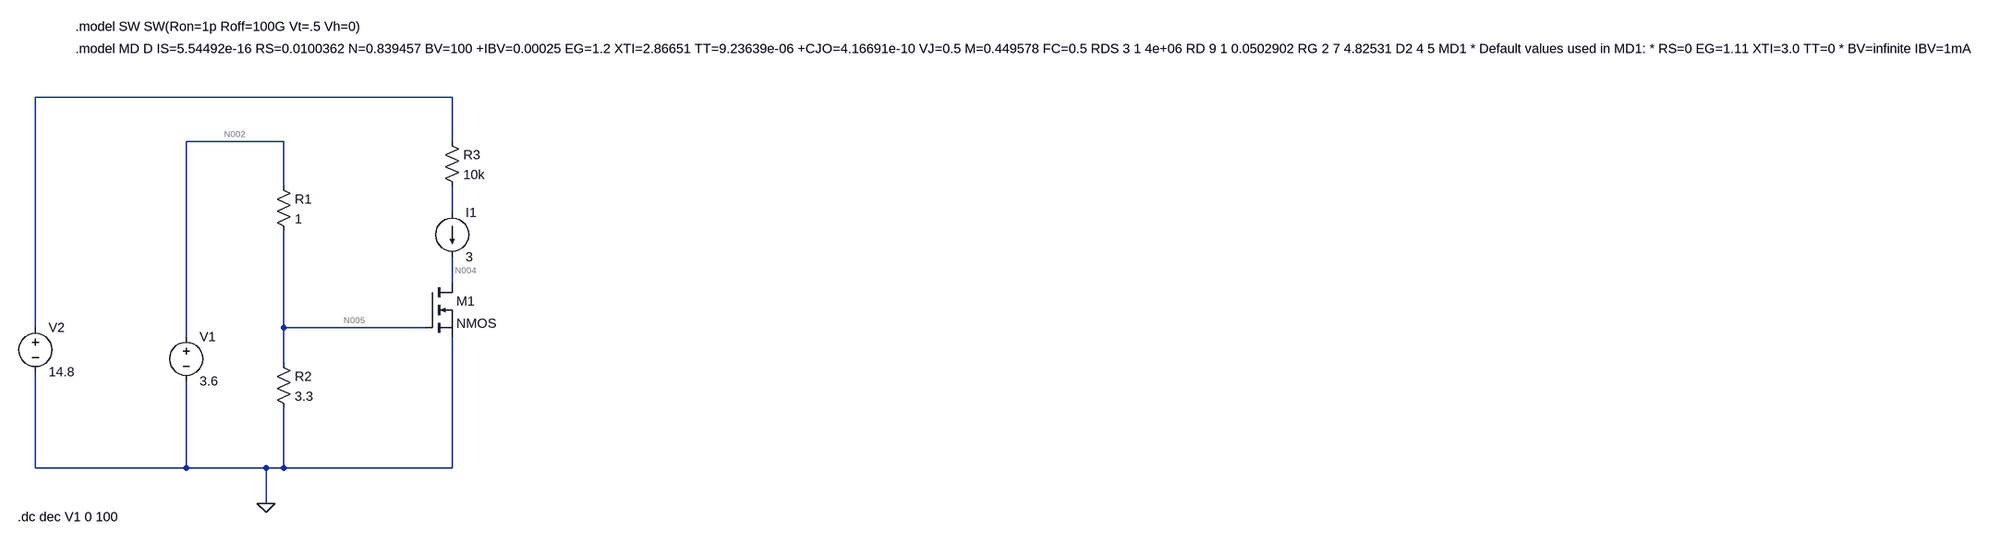
[diagram p0: schematic PolarizacionMos.asc]
PolarizacionMos.asc, the LTspice schematic file:
Version 4
SHEET 1 3660 712
WIRE 256 -208 -496 -208
WIRE -48 -128 -224 -128
WIRE 256 -128 256 -208
WIRE -48 -48 -48 -128
WIRE 256 0 256 -48
WIRE 256 128 256 80
WIRE -496 208 -496 -208
WIRE -48 208 -48 32
WIRE 208 208 -48 208
WIRE -224 224 -224 -128
WIRE -48 272 -48 208
WIRE -496 608 -496 288
WIRE -224 608 -224 304
WIRE -224 608 -496 608
WIRE -80 608 -224 608
WIRE -48 608 -48 352
WIRE -48 608 -80 608
WIRE 256 608 256 224
WIRE 256 608 -48 608
WIRE -80 672 -80 608
FLAG -80 672 0
SYMBOL voltage -224 208 R0
WINDOW 123 0 0 Left 0
WINDOW 39 0 0 Left 0
SYMATTR InstName V1
SYMATTR Value 3.6
SYMBOL res -64 -64 R0
SYMATTR InstName R1
SYMATTR Value 1
SYMBOL res -64 256 R0
SYMATTR InstName R2
SYMATTR Value 3.3
SYMBOL nmos 208 128 R0
SYMATTR InstName M1
SYMBOL voltage -496 192 R0
WINDOW 123 0 0 Left 0
WINDOW 39 0 0 Left 0
SYMATTR InstName V2
SYMATTR Value 14.8
SYMBOL res 240 -144 R0
SYMATTR InstName R3
SYMATTR Value 10k
SYMBOL load2 256 0 R0
WINDOW 123 0 0 Left 0
WINDOW 39 0 0 Left 0
SYMATTR InstName I1
SYMATTR Value 3
TEXT -424 -296 Left 2 !.model MD D IS=5.54492e-16 RS=0.0100362 N=0.839457 BV=100 +IBV=0.00025 EG=1.2 XTI=2.86651 TT=9.23639e-06 +CJO=4.16691e-10 VJ=0.5 M=0.449578 FC=0.5 RDS 3 1 4e+06 RD 9 1 0.0502902 RG 2 7 4.82531 D2 4 5 MD1 * Default values used in MD1: * RS=0 EG=1.11 XTI=3.0 TT=0 * BV=infinite IBV=1mA
TEXT -424 -336 Left 2 !.model SW SW(Ron=1p Roff=100G Vt=.5 Vh=0)
TEXT -528 696 Left 2 !.dc dec V1 0 100

The netlist it stands for:
* PolarizacionMos.asc
V1 N002 0 3.6
R1 N002 N005 1
R2 N005 0 3.3
M1 N004 N005 0 0 NMOS
V2 N001 0 14.8
R3 N001 N003 10k
I1 N003 N004 3
.model NMOS NMOS
.model PMOS PMOS
.lib standard.mos
.model MD D IS=5.54492e-16 RS=0.0100362 N=0.839457 BV=100 +IBV=0.00025 EG=1.2 XTI=2.86651 TT=9.23639e-06 +CJO=4.16691e-10 VJ=0.5 M=0.449578 FC=0.5 RDS 3 1 4e+06 RD 9 1 0.0502902 RG 2 7 4.82531 D2 4 5 MD1 * Default values used in MD1: * RS=0 EG=1.11 XTI=3.0 TT=0 * BV=infinite IBV=1mA
.model SW SW(Ron=1p Roff=100G Vt=.5 Vh=0)
.dc dec V1 0 100
.backanno
.end

* Results of the author's LTspice run, read from the files saved beside the schematic
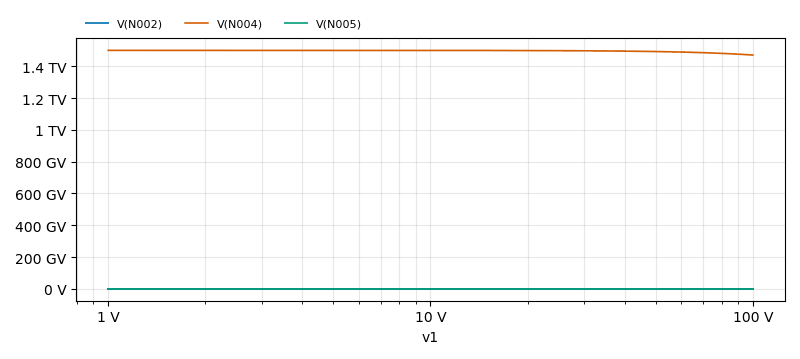
[diagram p1: DC transfer characteristic of PolarizacionMos.asc, plotted from the saved traces]
* DC transfer characteristic, 1 run:
*   V(N002): 1 V at v1=1 V, 100 V at v1=100 V, min 1 V, max 100 V
*   V(N004): 1.5 TV at v1=1 V, 1.471 TV at v1=100 V, min 1.471 TV, max 1.5 TV
*   V(N005): 767.4 mV at v1=1 V, 76.74 V at v1=100 V, min 767.4 mV, max 76.74 V